# Altium project dali.PrjPcb
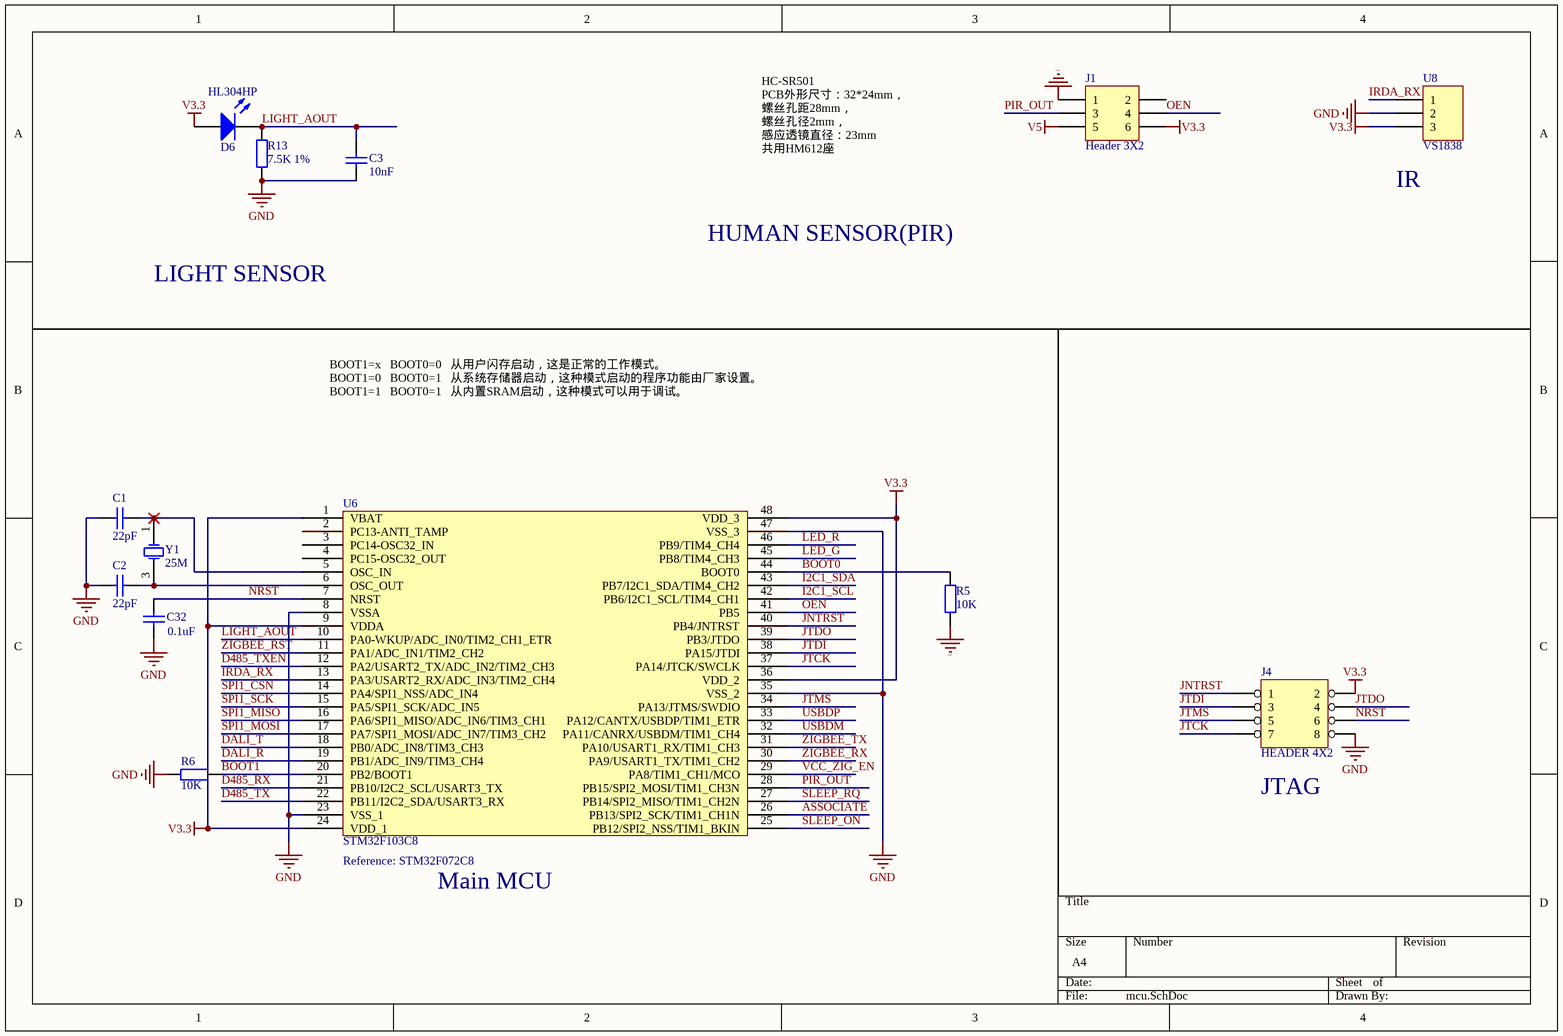
[diagram p0: mcu.SchDoc]
2 sheets, 92 parts. Net scope: global (net labels, ports and power ports of the same name join across sheets).
Board file: Dali.PcbDoc
Sheets:
  mcu.SchDoc
  zigbee.SchDoc

## Sheet mcu.SchDoc
size A4; DrawnBy: Forrest Gu; DocumentNumber: 1; Revision: 1.0; SheetNumber: 1; SheetTotal: 5

### Parts
C1  22pF  [0603]
C2  22pF  [0603]
C3  10nF  [0603]
C32  0.1uF  [0603]
D6  HL304HP  [LED_A2]
J1  Header 3X2  [HC-SR501-V1]
J4  HEADER 4X2  [HDR2X4]
R5  10K  [0603R]
R6  10K  [0603R]
R13  7.5K 1%  [0603R]
U6  STM32F103C8  [LQFP48S]
U8  VS1838  [HDR1X3]
Y1  25M  [3225]

### Nets
GND: C1.1 C2.1 C3.1 C32.1 J1.1 J4.8 R5.2 R6.1 R13.2 U6.8(VSSA) U6.23(VSS_1) U6.35(VSS_2) U6.47(VSS_3) U8.2  [project net N_OUT]
V3.3: D6.1(A) J1.6 J4.2 U6.1(VBAT) U6.9(VDDA) U6.24(VDD_1) U6.36(VDD_2) U6.48(VDD_3) U8.3
V5: J1.5
ASSOCIATE: U6.26(PB13/SPI2_SCK/TIM1_CH1N)
BOOT0: R5.1 U6.44(BOOT0)
BOOT1: R6.2 U6.20(PB2/BOOT1)
D485_RX: U6.21(PB10/I2C2_SCL/USART3_TX)
D485_TX: U6.22(PB11/I2C2_SDA/USART3_RX)
D485_TXEN: U6.12(PA2/USART2_TX/ADC_IN2/TIM2_CH3)
DALI_R: U6.19(PB1/ADC_IN9/TIM3_CH4)
DALI_T: U6.18(PB0/ADC_IN8/TIM3_CH3)
I2C1_SCL: U6.42(PB6/I2C1_SCL/TIM4_CH1)
I2C1_SDA: U6.43(PB7/I2C1_SDA/TIM4_CH2)
IRDA_RX: U6.13(PA3/USART2_RX/ADC_IN3/TIM2_CH4) U8.1
JNTRST: J4.1 U6.40(PB4/JNTRST)
JTCK: J4.7 U6.37(PA14/JTCK/SWCLK)
JTDI: J4.3 U6.38(PA15/JTDI)
JTDO: J4.4 U6.39(PB3/JTDO)
JTMS: J4.5 U6.34(PA13/JTMS/SWDIO)
LED_G: U6.45(PB8/TIM4_CH3)
LED_R: U6.46(PB9/TIM4_CH4)
LIGHT_AOUT: C3.2 D6.2(K) R13.1 U6.10(PA0-WKUP/ADC_IN0/TIM2_CH1_ETR)
NRST: C32.2 J4.6 U6.7(NRST)
OEN: J1.4 U6.41(PB5)
PIR_OUT: J1.3 U6.28(PB15/SPI2_MOSI/TIM1_CH3N)
SLEEP_ON: U6.25(PB12/SPI2_NSS/TIM1_BKIN)
SLEEP_RQ: U6.27(PB14/SPI2_MISO/TIM1_CH2N)
SPI1_CSN: U6.14(PA4/SPI1_NSS/ADC_IN4)
SPI1_MISO: U6.16(PA6/SPI1_MISO/ADC_IN6/TIM3_CH1)
SPI1_MOSI: U6.17(PA7/SPI1_MOSI/ADC_IN7/TIM3_CH2)
SPI1_SCK: U6.15(PA5/SPI1_SCK/ADC_IN5)
USBDM: U6.32(PA11/CANRX/USBDM/TIM1_CH4)
USBDP: U6.33(PA12/CANTX/USBDP/TIM1_ETR)
VCC_ZIG_EN: U6.29(PA8/TIM1_CH1/MCO)
ZIGBEE_RST: U6.11(PA1/ADC_IN1/TIM2_CH2)
ZIGBEE_RX: U6.30(PA9/USART1_TX/TIM1_CH2)
ZIGBEE_TX: U6.31(PA10/USART1_RX/TIM1_CH3)
NetC1_2: C1.2 U6.5(OSC_IN) Y1.1(OSC1)
NetC2_2: C2.2 U6.6(OSC_OUT) Y1.3(OSC2)

Not connected (* = marked no-connect by the designer): J1 2; U6 2(PC13-ANTI_TAMP) 3(PC14-OSC32_IN) 4(PC15-OSC32_OUT)

### Notes on the sheet
- HC-SR501
  PCB外形尺寸：32*24mm，
  螺丝孔距28mm，
  螺丝孔径2mm，
  感应透镜直径：23mm
  共用HM612座
- HUMAN SENSOR(PIR)
- (near U8) IR
- LIGHT SENSOR
- BOOT1=x   BOOT0=0   从用户闪存启动，这是正常的工作模式。
  BOOT1=0   BOOT0=1   从系统存储器启动，这种模式启动的程序功能由厂家设置。
  BOOT1=1   BOOT0=1   从内置SRAM启动，这种模式可以用于调试。
- (near J4) JTAG
- (near U6) Reference: STM32F072C8
- (near U6) Main MCU

### Library data of the parts
C1 C2 C32 = Cap: Capacitor; Published: 8-Jun-2000; LatestRevisionDate: 17-Jul-2002; LatestRevisionNote: Re-released for DXP Platform.; PackageReference: RAD-0.3; Publisher: Altium Limited
  C1 C2: Value: 22pF
  C32: Value: 0.1uF
C3 = Cap: Capacitor; Value: 0.1uF; Published: 8-Jun-2000; LatestRevisionDate: 17-Jul-2002; LatestRevisionNote: Re-released for DXP Platform.; PackageReference: RAD-0.3; Publisher: Altium Limited
D6 = LED0: 3MM光敏传感器; Published: 8-Jun-2000; LatestRevisionDate: 08-Jul-2005; LatestRevisionNote: Mech Layer 1 removed.; PackageReference: LED-0; Publisher: Altium Limited
J1 = Header 3X2: Header, 3-Pin, Dual row; LatestRevisionDate: 17-Jul-2002; LatestRevisionNote: Re-released for DXP Platform.; Publisher: Altium Limited
R5 R6 R13 = Res2: Resistor; Value: 1K; Published: 8-Jun-2000; LatestRevisionDate: 17-Jul-2002; LatestRevisionNote: Re-released for DXP Platform.; PackageReference: AXIAL-0.4; Publisher: Altium Limited
U6 = STM32F103C6
U8 = Header 3: Header, 3-Pin; LatestRevisionDate: 17-Jul-2002; LatestRevisionNote: Re-released for DXP Platform.; Publisher: Altium Limited
Y1 = XTAL_4pin: Crystal Oscillator; Published: 8-Jun-2000; LatestRevisionDate: 17-Jul-2002; LatestRevisionNote: Re-released for DXP Platform.; PackageReference: R38; Publisher: Altium Limited

## Sheet zigbee.SchDoc
size A4; DrawnBy: Forrest Gu; DocumentNumber: 4; Revision: 1.0; SheetNumber: 4; SheetTotal: 5
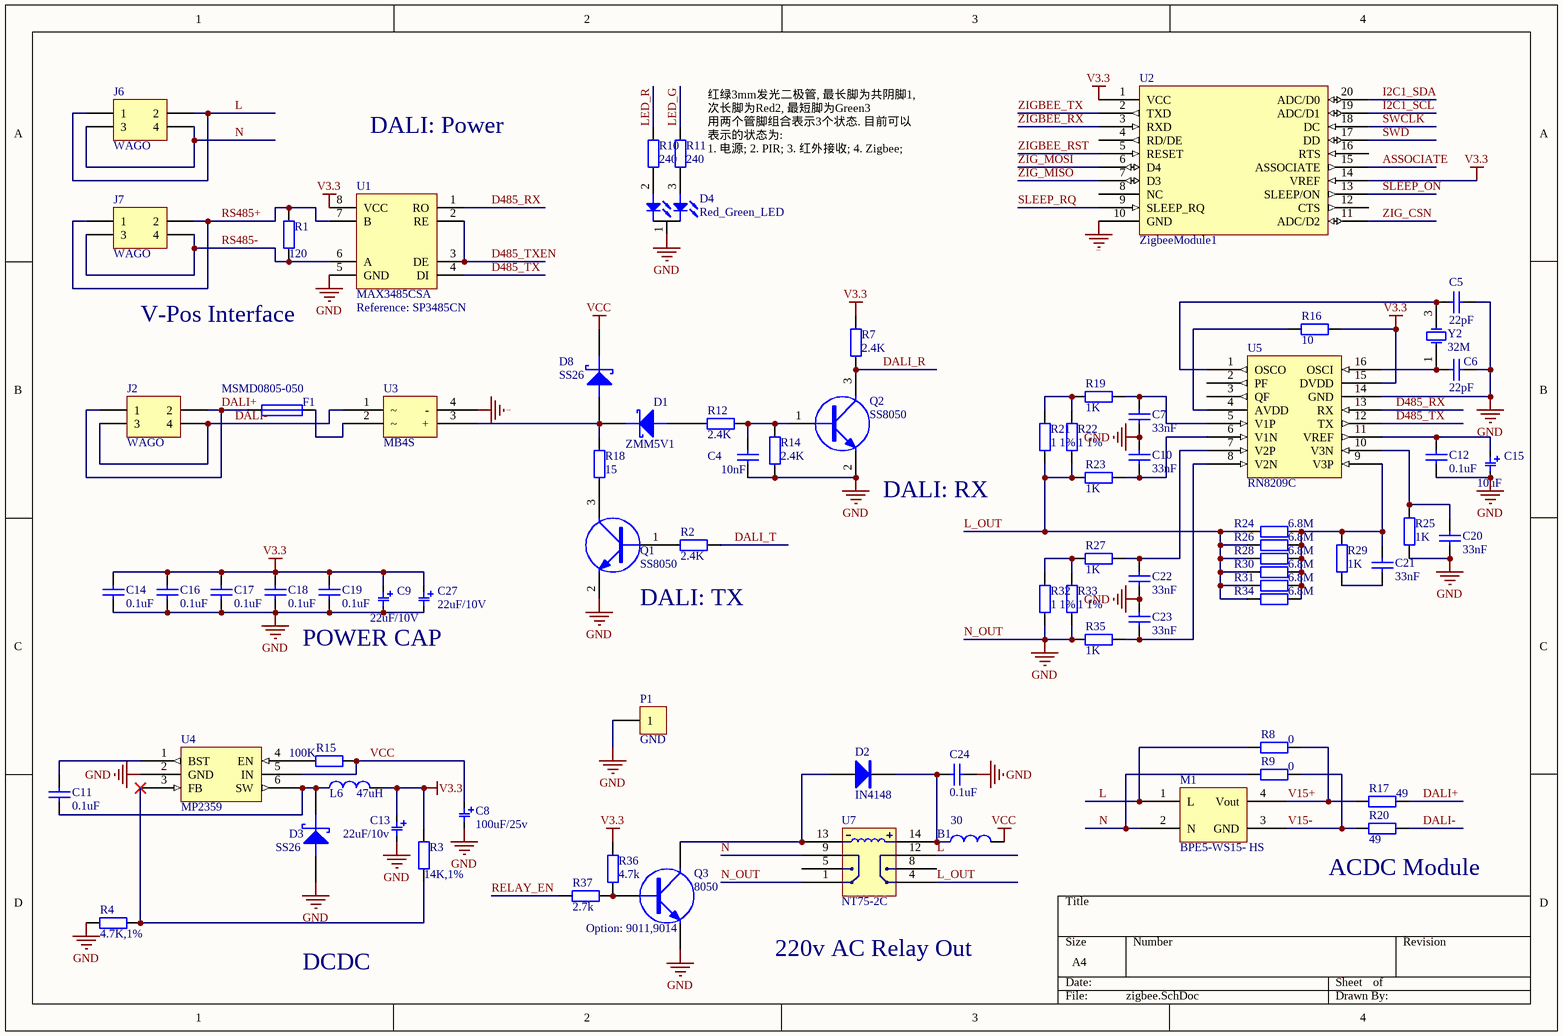
[diagram p1: zigbee.SchDoc]

### Parts
B1  30  [0805]
C4  10nF  [0603]
C5  22pF  [0603]
C6  22pF  [0603]
C7  33nF  [0603]
C8  100uF/25v  [CAP-7343]
C9  22uF/10V  [0805]
C10  33nF  [0603]
C11  0.1uF  [0603]
C12  0.1uF  [0603]
C13  22uF/10v  [0805]
C14  0.1uF  [0603]
C15  10uF  [0805]
C16  0.1uF  [0603]
C17  0.1uF  [0603]
C18  0.1uF  [0603]
C19  0.1uF  [0603]
C20  33nF  [0603]
C21  33nF  [0603]
C22  33nF  [0603]
C23  33nF  [0603]
C24  0.1uF  [0603]
C27  22uF/10V  [0805]
D1  ZMM5V1  [DIODE_1206]
D2  IN4148  [DIODE_1206_AK]
D3  SS26  [DO-214AC]
D4  Red_Green_LED  [LED_RG_3mm]
D8  SS26  [DO-214AC]
F1  MSMD0805-050  [0805]
J2  WAGO  [kf141r-2]
J6  WAGO  [kf141r-2]
J7  WAGO  [kf141r-2]
L6  47uH  [cd43]
M1  BPE5-WS15- HS  [BPE5-WS- HS]
P1  GND  [TP]
Q1  SS8050  [SOT-23]
Q2  SS8050  [SOT-23]
Q3  8050  [SOT-23]
R1  120  [0603r]
R2  2.4K  [0603r]
R3  14K,1%  [0603r]
R4  4.7K,1%  [0603r]
R7  2.4K  [0603r]
R8  0  [0603r]
R9  0  [0603r]
R10  240  [0603r]
R11  240  [0603r]
R12  2.4K  [0603r]
R14  2.4K  [0603r]
R15  100K  [0603r]
R16  10  [0603r]
R17  49  [0603r]
R18  15  [0603r]
R19  1K  [0603r]
R20  49  [0603r]
R21  1 1%  [0603r]
R22  1 1%  [0603r]
R23  1K  [0603r]
R24  6.8M  [0603r]
R25  1K  [0603r]
R26  6.8M  [0603r]
R27  1K  [0603r]
R28  6.8M  [0603r]
R29  1K  [0603r]
R30  6.8M  [0603r]
R31  6.8M  [0603r]
R32  1 1%  [0603r]
R33  1 1%  [0603r]
R34  6.8M  [0603r]
R35  1K  [0603r]
R36  4.7k  [0603r]
R37  2.7k  [0603r]
U1  MAX3485CSA  [NSO8_N]
U2  ZigbeeModule1  [ZIGBEE_XIAMENSIXIN]
U3  MB4S  [so-04-1]
U4  MP2359  [TSOT23-6]
U5  RN8209C  [SO-16]
U7  NT75-2C  [NT75-2C]
Y2  32M  [3225]

### Nets
N_OUT: C4.2 C5.1 C6.1 C7.2 C8.2 C9.2 C10.1 C12.2 C13.2 C14.2 C15.2 C16.2 C17.2 C18.2 C19.2 C20.2 C22.2 C23.1 C24.2 C27.2 D3.1(A) D4.1 P1.1 Q1.2(E) Q2.2(E) Q3.2(E) R4.1 R14.1 R25.2 R32.2 R33.2 R35.1 U1.5(GND) U2.10(GND) U3.4(-) U4.2(GND) U5.14(GND) U7.1  [also labelled GND]
V3.3: C9.1 C13.1 C14.1 C16.1 C17.1 C18.1 C19.1 C27.1 L6.1 R3.1 R7.1 R16.1 R36.1 U1.8(VCC) U2.1(VCC) U2.14(VREF) U5.15(DVDD)
VCC: B1.1 C8.1 D8.2(K) R15.1 U4.5(IN)
ASSOCIATE: U2.15(ASSOCIATE)
D485_RX: U1.1(RO) U5.13(RX)
D485_TX: U1.4(DI) U5.12(TX)
D485_TXEN: U1.2(RE) U1.3(DE)
DALI+: F1.1 J2.1 J2.2 R17.2
DALI-: J2.3 J2.4 R20.2 U3.1
DALI_R: Q2.3(C) R7.2
DALI_T: R2.1
I2C1_SCL: U2.19(ADC/D1)
I2C1_SDA: U2.20(ADC/D0)
L: J6.1 J6.2 M1.1(L) R8.1 U7.12
L_OUT: R21.2 R22.2 R23.1 R24.2 R26.2 R28.2 R30.2 R31.2 R34.2 U7.4
LED_G: R11.1
LED_R: R10.1
N: J6.3 J6.4 M1.2(N) R9.1 U7.9
RELAY_EN: R37.2
RS485+: J7.1 J7.2 R1.1 U1.7(B)
RS485-: J7.3 J7.4 R1.2 U1.6(A)
SLEEP_ON: U2.13(SLEEP/ON)
SLEEP_RQ: U2.9(SLEEP_RQ)
SWCLK: U2.18(DC)
SWD: U2.17(DD)
V15+: M1.4(Vout) R8.2 R17.1
V15-: M1.3(GND) R9.2 R20.1
ZIG_CSN: U2.11(ADC/D2)
ZIG_MISO: U2.7(D3)
ZIG_MOSI: U2.6(D4)
ZIGBEE_RST: U2.5(RESET)
ZIGBEE_RX: U2.3(RXD)
ZIGBEE_TX: U2.2(TXD)
NetB1_2: B1.2 C24.1 D2.K U7.14
NetC4_1: C4.1 Q2.1(B) R12.2 R14.2
NetC5_2: C5.2 U5.1(OSCO) Y2.3(OSC2)
NetC6_2: C6.2 U5.16(OSCI) Y2.1(OSC1)
NetC7_1: C7.1 R19.2 U5.5(V1P)
NetC10_2: C10.2 R23.2 U5.6(V1N)
NetC11_1: C11.1 D3.2(K) L6.2 U4.6(SW)
NetC11_2: C11.2 U4.1(BST)
NetC12_1: C12.1 C15.1 U5.11(VREF)
NetC20_1: C20.1 R25.1 U5.10(V3N)
NetC21_1: C21.1 R24.1 R26.1 R28.1 R29.1 R30.1 R31.1 R34.1 U5.9(V3P)
NetC21_2: C21.2 R29.2
NetC22_1: C22.1 R27.2 U5.7(V2P)
NetC23_2: C23.2 R35.2 U5.8(V2N)
NetD1_1: D1.1(A) R12.1
NetD1_2: D1.2(K) D8.1(A) R18.1 U3.3(+)
NetD2_A: D2.A Q3.3(C) U7.13
NetD4_2: D4.2(R) R10.2
NetD4_3: D4.3(G) R11.2
NetF1_2: F1.2 U3.2
NetQ1_1: Q1.1(B) R2.2
NetQ1_3: Q1.3(C) R18.2
NetQ3_1: Q3.1(B) R36.2 R37.1
NetR3_2: R3.2 R4.2 U4.3(FB)
NetR15_2: R15.2 U4.4(EN)
NetR16_2: R16.2 U5.4(AVDD)
NetR19_1: R19.1 R21.1 R22.1
NetR27_1: R27.1 R32.1 R33.1

Not connected (* = marked no-connect by the designer): U2 4(RD/DE) 8(NC) 12(CTS) 16(RTS); U5 2(PF) 3(QF); U7 5 8

### Notes on the sheet
- DALI: Power
- 红绿3mm发光二极管, 最长脚为共阴脚1, 次长脚为Red2, 最短脚为Green3
  用两个管脚组合表示3个状态. 目前可以表示的状态为:
  1. 电源; 2. PIR; 3. 红外接收; 4. Zigbee;
- (near U1) Reference: SP3485CN
- V-Pos Interface
- (near Q2) DALI: RX
- POWER CAP
- (near Q1) DALI: TX
- (near R20) ACDC Module
- DCDC
- (near Q3) Option: 9011,9014
- 220v AC Relay Out

### Library data of the parts
B1 L6 = L: 叠层电感
C4 C7 C10 C20-C23 = Cap: Capacitor; Value: 0.1uF; Published: 8-Jun-2000; LatestRevisionDate: 17-Jul-2002; LatestRevisionNote: Re-released for DXP Platform.; PackageReference: RAD-0.3; Publisher: Altium Limited
C5 C6 C11 C12 C14 C16-C19 C24 = Cap: Capacitor; Published: 8-Jun-2000; LatestRevisionDate: 17-Jul-2002; LatestRevisionNote: Re-released for DXP Platform.; PackageReference: RAD-0.3; Publisher: Altium Limited
  C5 C6: Value: 22pF
  C11 C12 C14 C16-C19 C24: Value: 0.1uF
C8 C9 C13 C15 C27 = ECAP
D1 = DIODE SCHOTTKY: Schottky Diode
D2 = DIODE
D3 D8 = SchottkyDiode: Schottky Diode
D4 = LED_RG
F1 = FUSE
J2 = Header 2X2: Header, 2-Pin, Dual row; LatestRevisionDate: 17-Jul-2002; LatestRevisionNote: Re-released for DXP Platform.; Publisher: Altium Limited
J6 J7 = Header 2X2: 2060-452/998-404; LatestRevisionDate: 17-Jul-2002; LatestRevisionNote: Re-released for DXP Platform.; Publisher: Altium Limited
M1 = BPE5-WS15- HS: 220v AC - 15DC module
P1 = CON1: Connector
Q1-Q3 = NPN: NPN Transistor
R1-R4 R7-R12 R14-R18 R20-R22 R24 R26 R28 R30-R34 R36 R37 = Res2: Resistor; Value: 1K; Published: 8-Jun-2000; LatestRevisionDate: 17-Jul-2002; LatestRevisionNote: Re-released for DXP Platform.; PackageReference: AXIAL-0.4; Publisher: Altium Limited
R19 R23 R25 R27 R29 R35 = Res2: Resistor; Published: 8-Jun-2000; LatestRevisionDate: 17-Jul-2002; LatestRevisionNote: Re-released for DXP Platform.; PackageReference: AXIAL-0.4; Publisher: Altium Limited; Value: 1K
U1 = SP3485: 485总线芯片
U2 = Zigbee_XiaMenSiXin: Zigbee module - xiamen SiXin
U4 = MP2359: Power Convertor
U5 = RN8209C: POWER METER
U7 = HH52B: Relay
Y2 = XTAL_4pin: Crystal Oscillator; Published: 8-Jun-2000; LatestRevisionDate: 17-Jul-2002; LatestRevisionNote: Re-released for DXP Platform.; PackageReference: R38; Publisher: Altium Limited

## Nets that join several sheets
N_OUT: mcu (14 pins), zigbee (38 pins)
V3.3: mcu (9 pins), zigbee (17 pins)
ASSOCIATE: mcu (U6.26), zigbee (U2.15)
D485_RX: mcu (U6.21), zigbee (U1.1 U5.13)
D485_TX: mcu (U6.22), zigbee (U1.4 U5.12)
D485_TXEN: mcu (U6.12), zigbee (U1.2 U1.3)
DALI_R: mcu (U6.19), zigbee (Q2.3 R7.2)
DALI_T: mcu (U6.18), zigbee (R2.1)
I2C1_SCL: mcu (U6.42), zigbee (U2.19)
I2C1_SDA: mcu (U6.43), zigbee (U2.20)
LED_G: mcu (U6.45), zigbee (R11.1)
LED_R: mcu (U6.46), zigbee (R10.1)
SLEEP_ON: mcu (U6.25), zigbee (U2.13)
SLEEP_RQ: mcu (U6.27), zigbee (U2.9)
ZIGBEE_RST: mcu (U6.11), zigbee (U2.5)
ZIGBEE_RX: mcu (U6.30), zigbee (U2.3)
ZIGBEE_TX: mcu (U6.31), zigbee (U2.2)